# EAGLE design MRCS-Remote-Switch-Motor-Controller (EAGLE 7.7.0)
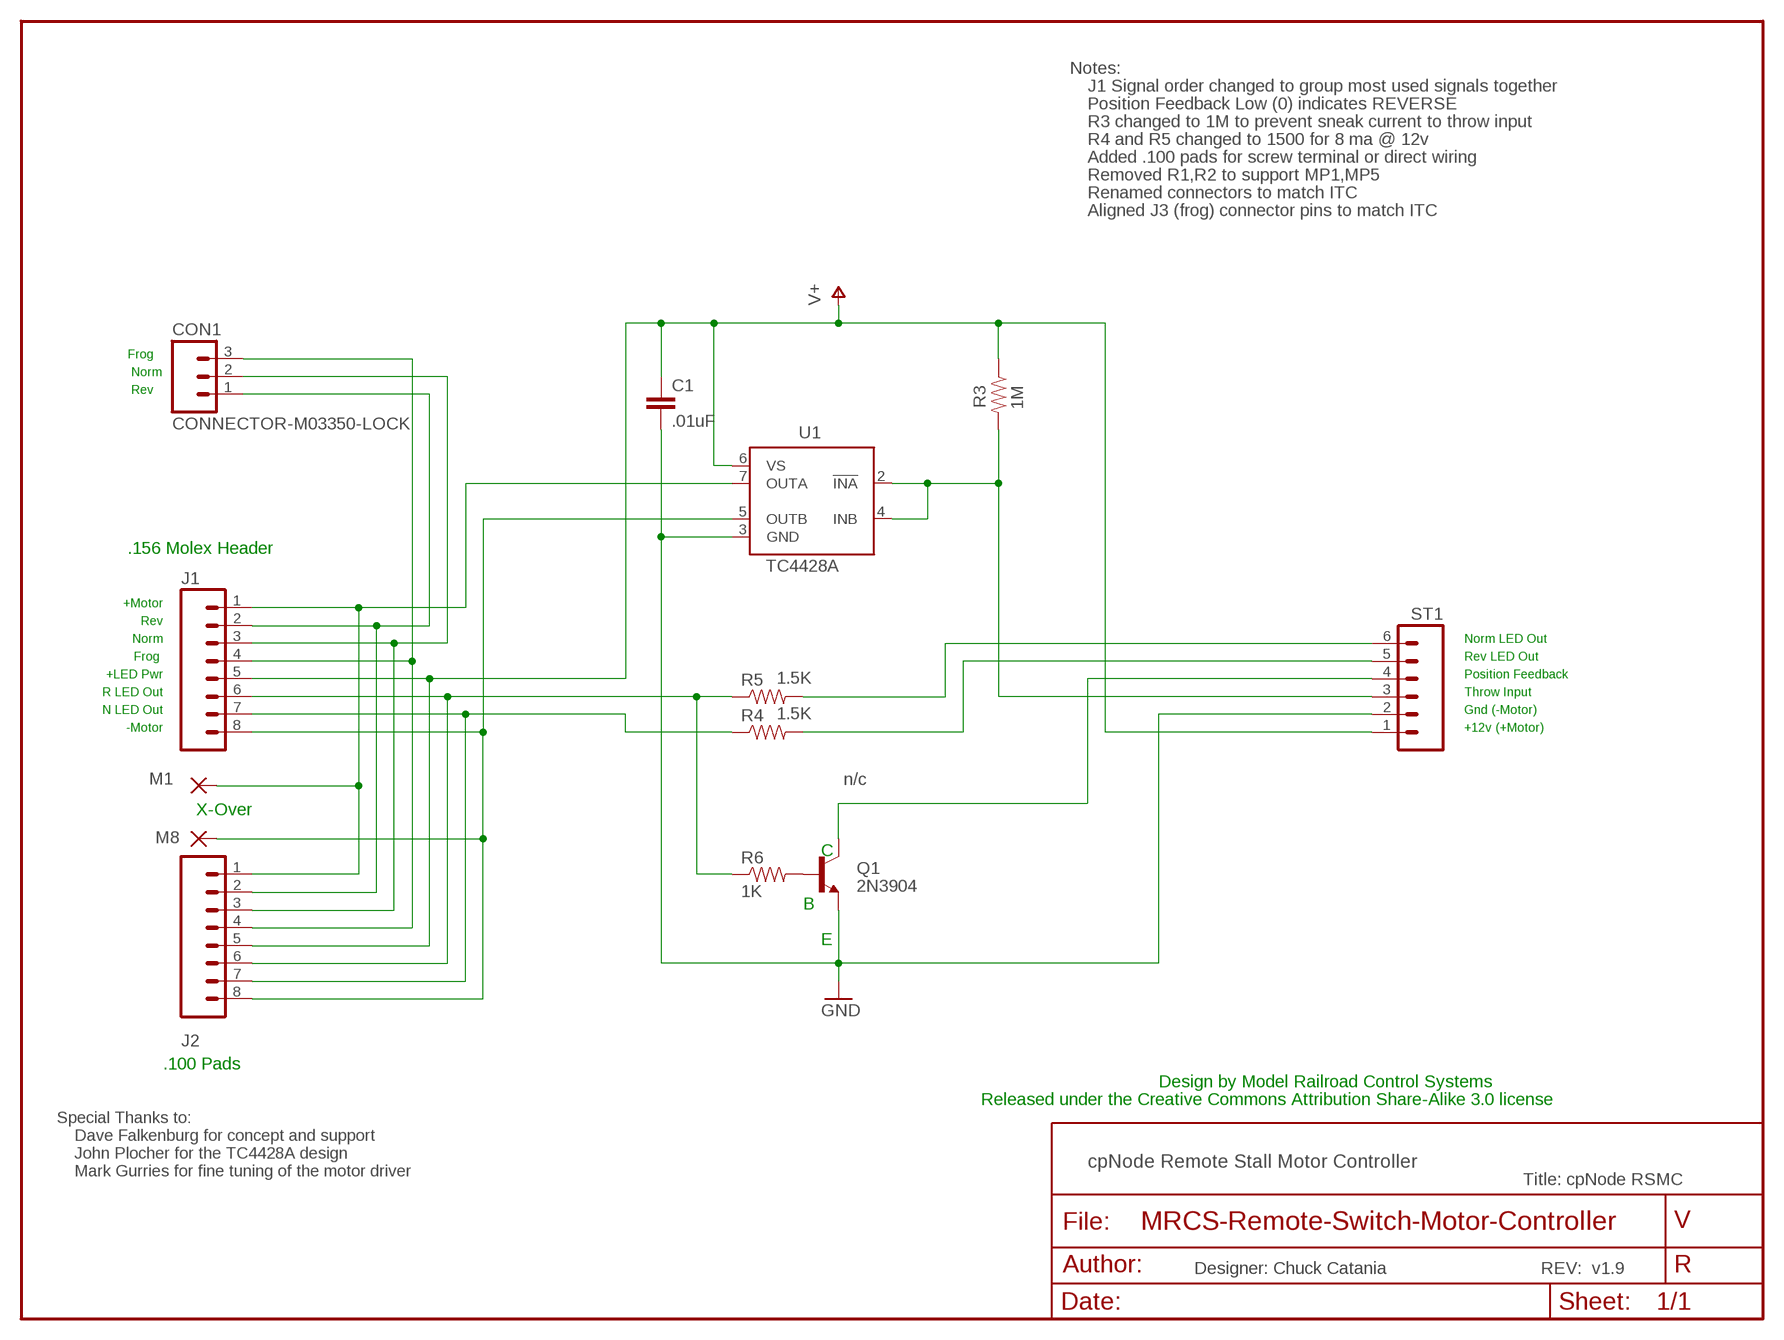
[diagram p0: schematic, sheet 1]

## Parts
C1  .01uF  CAPEZ  [CAP-PTH-SMALLEZ]
CON1  CONNECTOR-M03350-LOCK  [1751251]
J1  J1  CONNECTOR-M081.56-F  [KK-156-8-F]
J2  J2  M08  [1X08_PIN1_NO_SILK]
M1  WIREPAD2,54/1,1  [2,54/1,1]
M8  WIREPAD2,54/1,1  [2,54/1,1]
Q1  2N3904  NPN-MS-013  [TO-92-MS013]
R3  1M  RPTH04  [AXIAL-0.4-RES]
R4  1.5K  RPTH04  [AXIAL-0.4-RES]
R5  1.5K  RPTH04  [AXIAL-0.4-RES]
R6  1K  RPTH04  [AXIAL-0.4-RES]
ST1  M06LOCK  [1X06_LOCK]
U1  TC4428A  IR4428  [DIL08]

## Nets
FROG: CON1.3 J1.4 J2.4
GND: C1.2 Q1.1(E) ST1.2 U1.3(GND)
M+: J1.1 J2.1 M1.1(P) U1.7(OUTA)
M-: J1.8 J2.8 M8.1(P) U1.5(OUTB)
N$3: Q1.3(C) ST1.4
N$4: R4.P$2 ST1.5
N$8: Q1.2(B) R6.P$2
N$9: R5.P$2 ST1.6
N$14: R3.P$2 ST1.3 U1.2(!INA) U1.4(INB)
N-LED: J1.7 J2.7 R4.P$1
NORM: CON1.2 J1.3 J2.3
R-LED: J1.6 J2.6 R5.P$1 R6.P$1
REV: CON1.1 J1.2 J2.2
V+: C1.1 J1.5 J2.5 R3.P$1 ST1.1 U1.6(VS)

## Notes on the sheet
- Notes:
- J1 Signal order changed to group most used signals together
- Position Feedback Low (0) indicates REVERSE
- R3 changed to 1M to prevent sneak current to throw input
- R4 and R5 changed to 1500 for 8 ma @ 12v
- Added .100 pads for screw terminal or direct wiring
- Removed R1,R2 to support MP1,MP5
- Renamed connectors to match ITC
- Aligned J3 (frog) connector pins to match ITC
- Frog
- Norm
- Rev
- .156 Molex Header
- +Motor
- Rev
- Norm | Norm LED Out
- Frog | Rev LED Out
- +LED Pwr | Position Feedback
- R LED Out | Throw Input
- N LED Out | Gnd (-Motor)
- -Motor | +12v (+Motor)
- n/c
- X-Over
- C
- B
- E
- .100 Pads
- Design by Model Railroad Control Systems
- Released under the Creative Commons Attribution Share-Alike 3.0 license
- Special Thanks to:
- Dave Falkenburg for concept and support
- John Plocher for the TC4428A design
- cpNode Remote Stall Motor Controller
- Mark Gurries for fine tuning of the motor driver
- Title: cpNode RSMC
- Designer: Chuck Catania | REV:  v1.9

## Library data of the parts
C1 = SparkFun-Passives:CAP: Capacitor Standard 0603 ceramic capacitor, and 0.1" leaded capacitor.
CON1 = SPCoast:CONNECTOR-M03
J1 = SPCoast:CONNECTOR-M08: Header 8 Standard 8-pin 0.1" header. Use with straight break away headers (SKU : PRT-00116), right angle break away headers (PRT-00553), swiss pins (PRT-00743), machine pins (PRT-00117), and female headers (PRT-00115).
J2 = SparkFun-Connectors:M08: Header 8 Standard 8-pin 0.1" header. Use with straight break away headers (SKU : PRT-00116), right angle break away headers (PRT-00553), swiss pins (PRT-00743), machine pins (PRT-00117), and female headers (PRT-00115).
M1 M8 = wirepad:WIREPAD: Wire PAD connect wire on PCB
Q1 = SPCoast:NPN: Transistor NPN BJT configuration in SOT23 package. MMBT2222 is the common NPN we use. Double check BCE configuration again layout.
R3-R6 = SPCoast:R*: Resistor Basic schematic elements and footprints for 0603, 1206, and PTH 1/10th watt (small) resistors.
ST1 = SparkFun-Connectors:M06: Header 6 Standard 6-pin 0.1" header. Use with straight break away headers (SKU : PRT-00116), right angle break away headers (PRT-00553), swiss pins (PRT-00743), machine pins (PRT-00117), and female headers (PRT-00115). Molex polarized connector foot print use with SKU : PRT-08094 with associated crimp pins and housings. NOTES ON THE VARIANTS LOCK and LOCK_LONGPADS... This footprint was designed to help hold the alignment of a through-hole component (i.e. 6-pin header) while soldering it into place. You may notice that each hole has been shifted either up or down by 0.005 of an inch from it's more standard position (which is a perfectly straight line). This slight alteration caused the pins (the squares in the middle) to touch the edges of the holes. Because they are alternating, it causes a "brace" to hold the component in place. 0.005 has proven to be the perfect amount of "off-center" position when using our standard breakaway headers. Although looks a little odd when you look at the bare footprint, once you have a header in there, the alteration is very hard to notice. Also,if you push a header all the way into place, it is covered up entirely on the bottom side. This idea of altering the position of holes to aid alignment will be further integrated into the Sparkfun Library for other footprints. It can help hold any component with 3 or more connection pins.
U1 = ir:IR4428: DUAL LOW SIDE DRIVER Source: ID4426.pdf; MF: INTERNATIONAL RECTIFIER(IR); MPN: IR4428PBF; OC_FARNELL: 1023268; OC_NEWARK: 19K8464

## Board
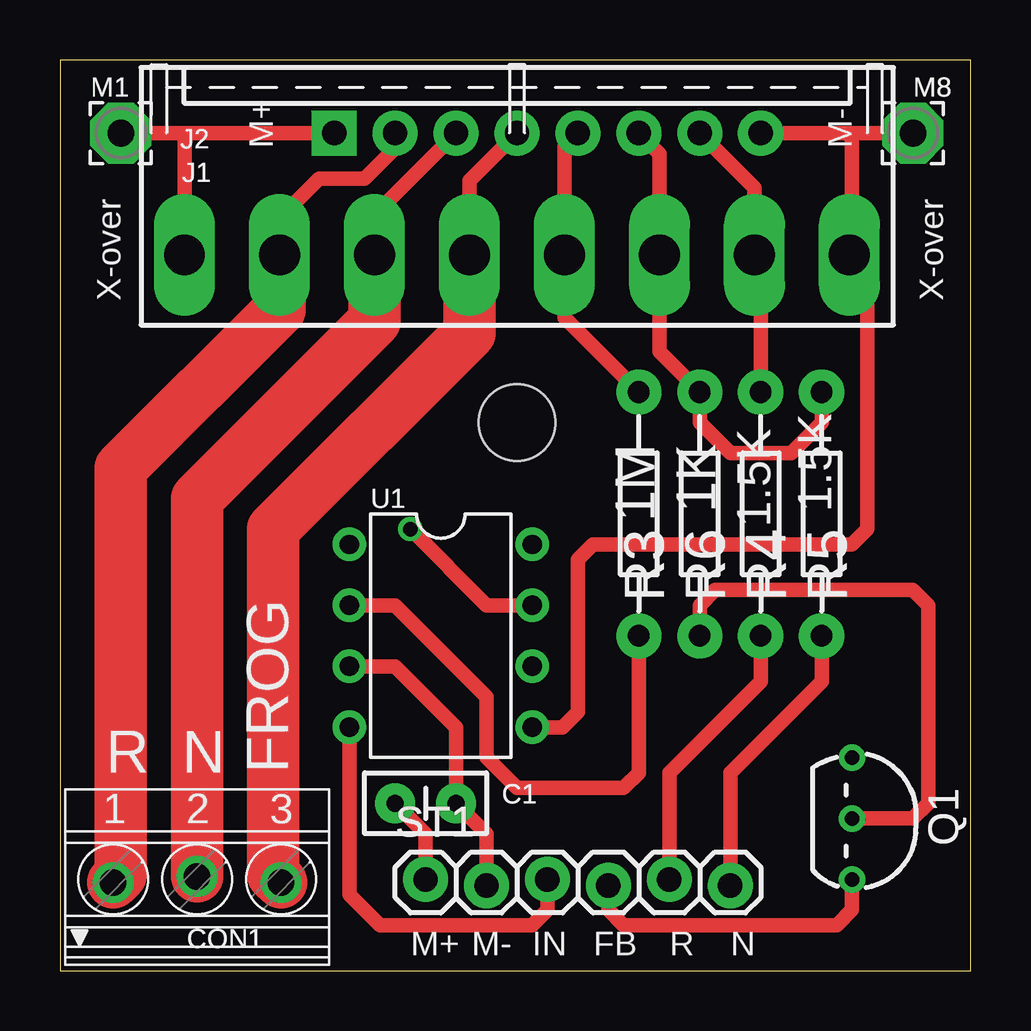
[diagram p1: board, top side]
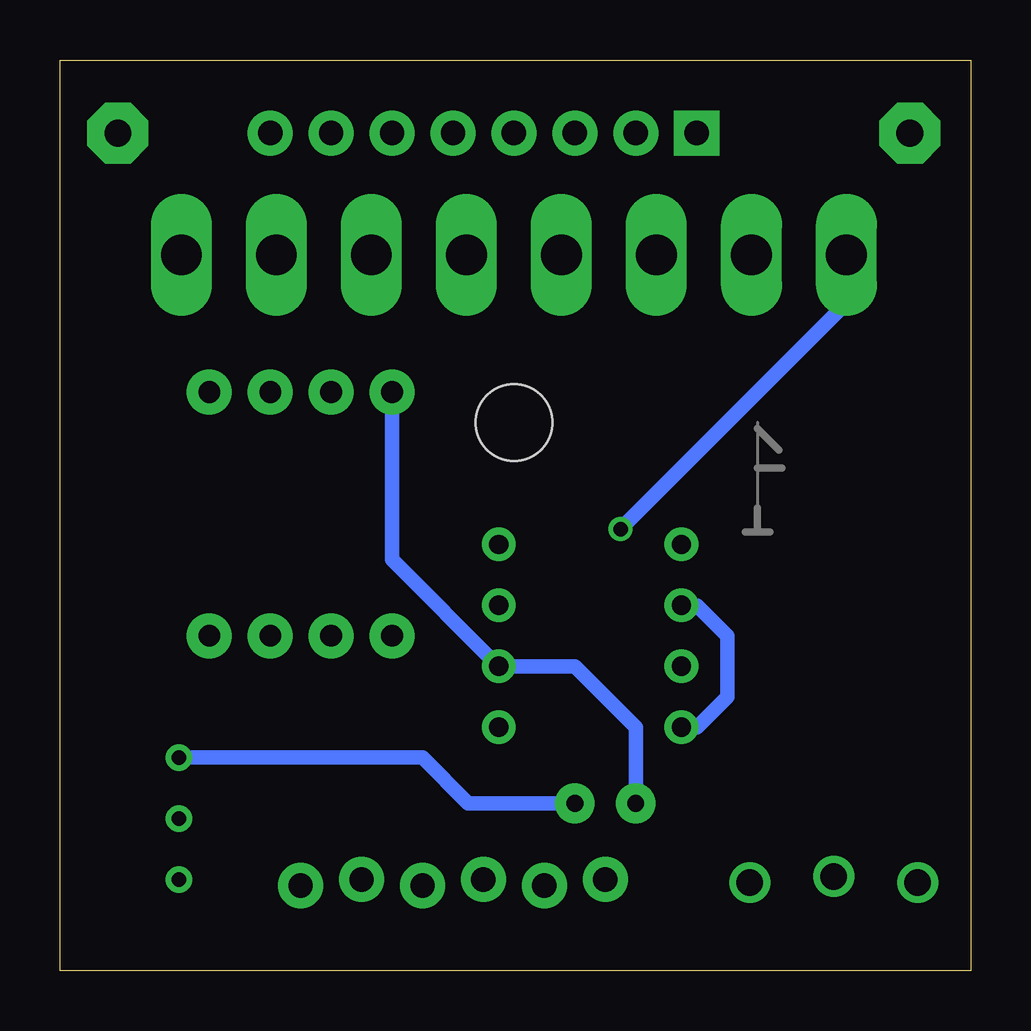
[diagram p2: board, bottom side, seen from below]

Size 37.97 x 37.97 mm. Coordinates in mm from the lower left corner, seen from the top.
Outline: 0,0 37.97,0 37.97,37.97 0,37.97 0,0
Copper layers (1*16): Top 0.035mm / dielectric 1.5mm / Bottom 0.035mm
Design rules "default": minimum track width 10mil, minimum drill 0.6mm, track to track 8mil, track to pad 8mil, pad to pad 8mil, via to via 8mil, smd to smd 8mil, copper to edge 40mil, drill to drill 8mil, minimum pad ring 10mil, minimum via ring 8mil, stop-mask expansion 4mil, vias tented up to drill 0mil, thermal gap 10mil
Holes 3.2 mm at 19.05,22.86

### Footprints (pad centres in the part's own frame; a part is rotated, then mirrored left to right if it is on the bottom)
CAP-PTH-SMALLEZ = drill 0.7 pad 1.651: 1 0,0; 2 2.54,0
1751251 = drill 1.1 pad 1.7: 1 -3.5,-0.127; 2 0,0.127; 3 3.5,-0.127
KK-156-8-F = drill 1.7 pad 2.184 long: 1 -13.86,0; 2 -9.9,0; 3 -5.94,0; 4 -1.98,0; 5 1.98,0; 6 5.94,0; 7 9.9,0; 8 13.86,0
1X08_PIN1_NO_SILK = drill 1.016 pad 1.88 square: 1 0,0 | drill 1.016 pad 1.88: 2 2.54,0; 3 5.08,0; 4 7.62,0; 5 10.16,0; 6 12.7,0; 7 15.24,0; 8 17.78,0
2,54/1,1 = drill 1.118 pad 2.54 octagon: 1 0,0
TO-92-MS013 = drill 0.6: 1 -2.54,0; 2 0,0; 3 2.54,0
AXIAL-0.4-RES = drill 0.9 pad 1.88: P$1 -5.08,0; P$2 5.08,0
1X06_LOCK = drill 1.016 pad 1.88: 1 0,0; 2 2.54,-0.254; 3 5.08,0; 4 7.62,-0.254; 5 10.16,0; 6 12.7,-0.254
DIL08 = drill 0.8 pad 1.4: 1 -3.81,-3.81; 2 -1.27,-3.81; 3 1.27,-3.81; 4 3.81,-3.81; 5 3.81,3.81; 6 1.27,3.81; 7 -1.27,3.81; 8 -3.81,3.81

### Placement (x,y rotation side)
C1  13.97,6.99 0 top
CON1  5.71,3.81 0 top
J1  19.05,29.84 0 top
J2  11.43,34.92 0 top
M1  2.54,34.92 0 top
M8  35.56,34.92 0 top
Q1  33.02,6.35 270 top
R3  24.13,19.05 270 top
R4  29.21,19.05 270 top
R5  31.75,19.05 270 top
R6  26.67,19.05 270 top
ST1  15.24,3.81 0 top
U1  15.88,13.97 270 top
U$1  [MRCSLOGOBTM]  2.54,17.78 0 top
U$2  [CA-PROP65WARNING]  24.13,27.94 0 top

### Tracks (layer width: path | path; a pad name or v marks a point on that pad's centre or on a via)
FROG
  Top 0.61: J1.4 17.07,32.95 J2.4
  Top 2.184: J1.4 17.07,26.59 8.89,18.41 8.89,4.01 CON1.3
GND
  Top 0.61: ST1.2 17.78,5.71 C1.2 16.51,10.16 13.97,12.7 U1.3
  Bottom 0.61: Q1.1 22.86,8.89 20.95,6.99 C1.2
M+  (via drill 0.6)
  Top 0.61: M1.1 5.08,34.92 | 5.08,34.92 J2.1 | J1.1 5.19,34.81 5.08,34.92 | U1.7 17.78,15.24 v14.61,18.41
  Bottom 0.61: v14.61,18.41 5.08,27.94 5.08,29.73 J1.1
M-
  Top 0.61: J2.8 33.02,34.92 | 33.02,34.92 M8.1 | 33.02,34.92 33.02,29.95 J1.8 33.66,29.1 33.66,18.41 33.02,17.78 22.23,17.78 21.59,17.14 21.59,10.79 20.95,10.16 U1.5
N$3
  Top 0.61: ST1.4 22.86,2.54 23.5,1.91 32.38,1.91 33.02,2.54 Q1.3
N$4
  Top 0.61: ST1.5 25.4,8.26 29.21,12.06 R4.P$2
N$8
  Top 0.61: Q1.2 35.56,6.35 36.2,6.99 36.2,15.24 35.56,15.88 27.3,15.88 26.67,15.24 R6.P$2
N$9
  Top 0.61: ST1.6 27.94,8.26 31.75,12.06 R5.P$2
N$14
  Top 0.61: U1.4 12.06,3.17 13.34,1.91 19.68,1.91 20.32,2.54 ST1.3 | U1.2 13.97,15.24 17.78,11.43 17.78,8.89 19.05,7.62 23.5,7.62 24.13,8.26 R3.P$2
  Bottom 0.61: U1.4 11.43,10.16 10.16,11.43 10.16,13.97 11.43,15.24 U1.2
N-LED
  Top 0.61: J2.7 28.95,32.65 J1.7 29.21,29.59 R4.P$1
NORM
  Top 0.61: J1.3 13.11,31.52 J2.3
  Top 2.184: J1.3 13.11,27.08 5.71,19.68 CON1.2
R-LED
  Top 0.61: J2.6 24.99,34.06 J1.6 24.99,25.81 R6.P$1 26.67,22.86 27.94,21.59 30.48,21.59 31.75,22.86 R5.P$1
REV
  Top 0.61: J1.2 9.15,31.38 10.79,33.02 12.7,33.02 13.97,34.29 J2.2
  Top 2.184: J1.2 9.15,27.57 2.54,20.95 2.54,4.01 CON1.1
V+
  Top 0.61: J2.5 21.03,34.37 J1.5 21.03,27.23 R3.P$1 | ST1.1 15.24,5.71 C1.1
  Bottom 0.61: R3.P$1 24.13,17.14 U1.6 16.51,12.7 13.97,10.16 C1.1

### Text on the board
tPlace: M+ | M- | X-over | X-over | R | N | FROG | M+ | M- | IN | FB | R | N
bDocu: RSMC V1.9a
_tNames: M1 | M1 | M1 | M8 | M8 | M8 | J2 | J2 | J2 | J1 | J1 | J1 | U1 | U1 | U1 | R3 | R3 | R3 | R6 | R6 | R6 | R4 | R4 | R4 | R5 | R5 | R5 | Q1 | Q1 | Q1 | C1 | C1 | C1 | ST1 | ST1 | ST1 | CON1 | CON1 | CON1